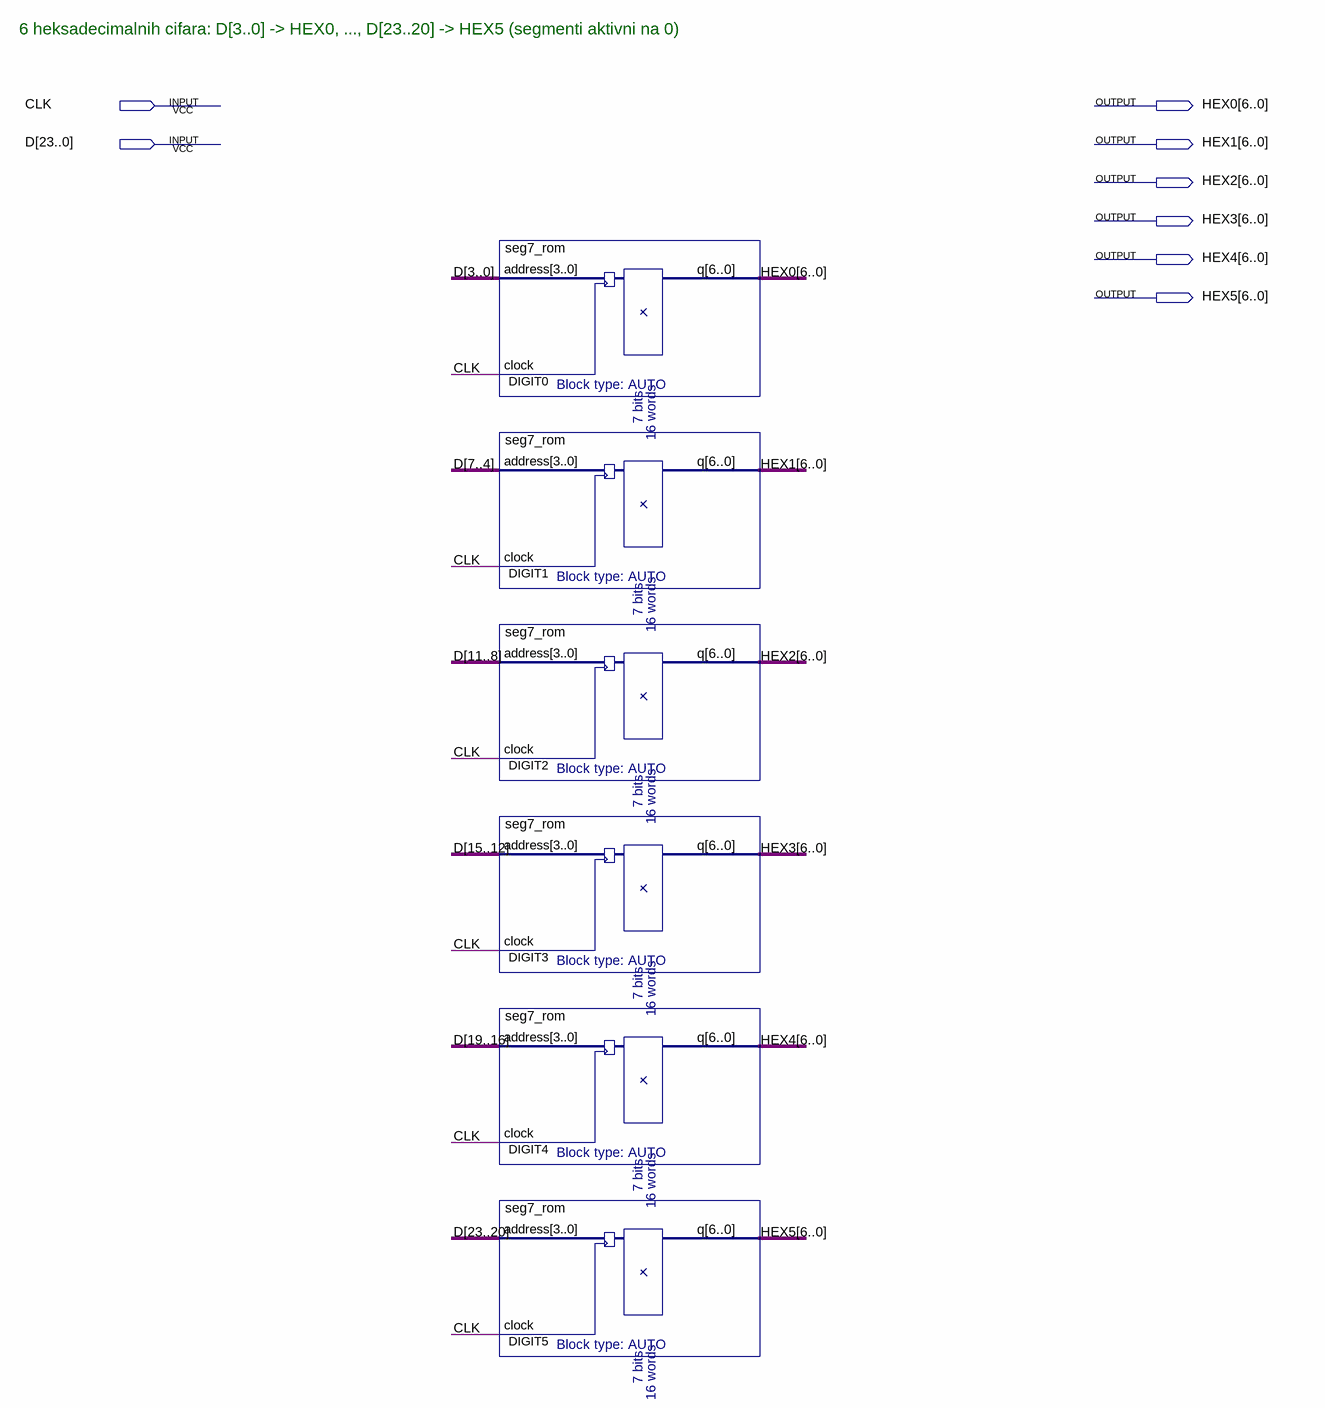
[diagram p0: schematic sheet]
// Quartus schematic seg7_display.bdf as structural Verilog: 6 symbols, 8 pins
module seg7_display (
  input  CLK,
  input  [23:0] D,
  output [6:0] HEX0,
  output [6:0] HEX1,
  output [6:0] HEX2,
  output [6:0] HEX3,
  output [6:0] HEX4,
  output [6:0] HEX5
);

  seg7_rom DIGIT0 (.address(D[3:0]), .clock(CLK), .q(HEX0));
  seg7_rom DIGIT1 (.address(D[7:4]), .clock(CLK), .q(HEX1));
  seg7_rom DIGIT2 (.address(D[11:8]), .clock(CLK), .q(HEX2));
  seg7_rom DIGIT3 (.address(D[15:12]), .clock(CLK), .q(HEX3));
  seg7_rom DIGIT4 (.address(D[19:16]), .clock(CLK), .q(HEX4));
  seg7_rom DIGIT5 (.address(D[23:20]), .clock(CLK), .q(HEX5));

  // Notes on the sheet:
  //   6 heksadecimalnih cifara: D[3..0] -> HEX0, ..., D[23..20] -> HEX5 (segmenti aktivni na 0)
endmodule
